# Altium schematic sheet USB-C_Connectors.SchDoc
size A4
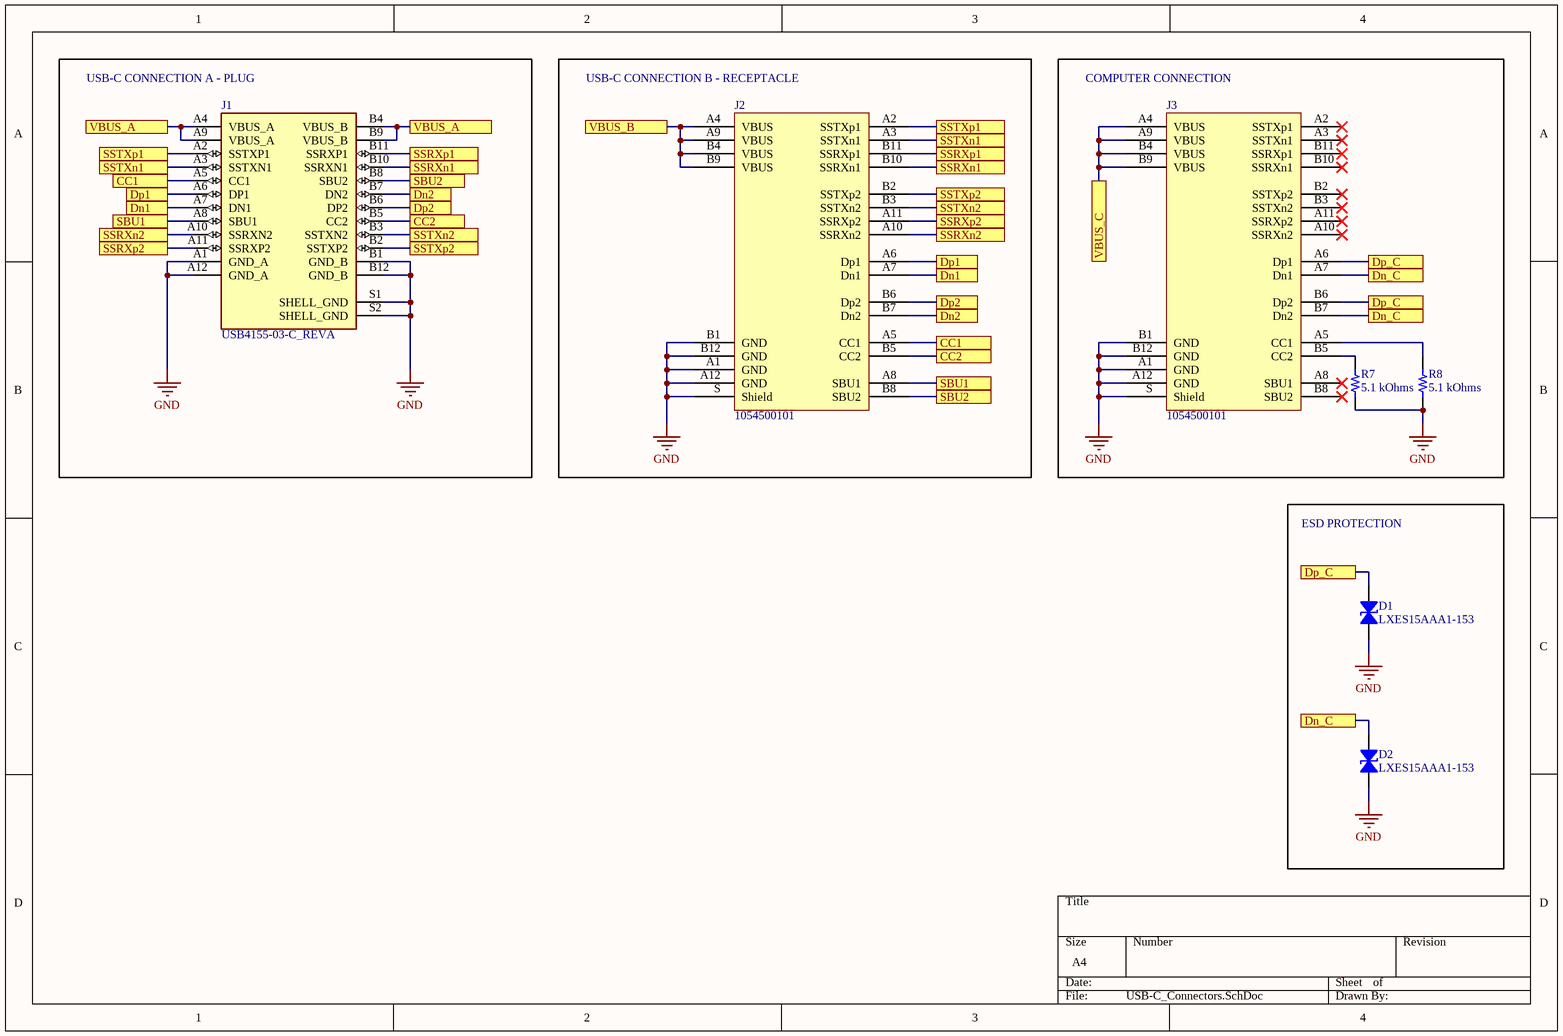
[diagram p0: USB-C_Connectors.SchDoc]

## Parts
D1  LXES15AAA1-153  [0402]
D2  LXES15AAA1-153  [0402]
J1  USB4155-03-C_REVA  [GCT_USB4155-03-C_REVA]
J2  1054500101  [Molex 1054500101]
J3  1054500101  [Molex 1054500101]
R7  5.1 kOhms  [RES 0603_1608]
R8  5.1 kOhms  [RES 0603_1608]

## Blocks framed on the sheet
USB-C CONNECTION A - PLUG: J1
USB-C CONNECTION B - RECEPTACLE: J2
COMPUTER CONNECTION: J3 R7 R8
ESD PROTECTION: D1 D2

## Ports
CC1, CC2, Dn1, Dn2, Dn_C, Dp1, Dp2, Dp_C, SBU1, SBU2, SSRXn1, SSRXn2, SSRXp1, SSRXp2, SSTXn1, SSTXn2, SSTXp1, SSTXp2, VBUS_A, VBUS_B, VBUS_C

## Nets
GND: D1.2 D2.2 J1.A1(GND_A) J1.A12(GND_A) J1.B1(GND_B) J1.B12(GND_B) J1.S1(SHELL_GND) J1.S2(SHELL_GND) J2.A1(GND) J2.A12(GND) J2.B1(GND) J2.B12(GND) J2.S(Shield) J3.A1(GND) J3.A12(GND) J3.B1(GND) J3.B12(GND) J3.S(Shield) R7.1 R8.2
CC1: J1.A5(CC1) J2.A5(CC1) ; port CC1
CC2: J1.B5(CC2) J2.B5(CC2) ; port CC2
Dn1: J1.A7(DN1) J2.A7(Dn1) ; port Dn1
Dn2: J1.B7(DN2) J2.B7(Dn2) ; port Dn2
Dn_C: D2.1 J3.A7(Dn1) J3.B7(Dn2) ; port Dn_C
Dp1: J1.A6(DP1) J2.A6(Dp1) ; port Dp1
Dp2: J1.B6(DP2) J2.B6(Dp2) ; port Dp2
Dp_C: D1.1 J3.A6(Dp1) J3.B6(Dp2) ; port Dp_C
SBU1: J1.A8(SBU1) J2.A8(SBU1) ; port SBU1
SBU2: J1.B8(SBU2) J2.B8(SBU2) ; port SBU2
SSRXn1: J1.B10(SSRXN1) J2.B10(SSRXn1) ; port SSRXn1
SSRXn2: J1.A10(SSRXN2) J2.A10(SSRXn2) ; port SSRXn2
SSRXp1: J1.B11(SSRXP1) J2.B11(SSRXp1) ; port SSRXp1
SSRXp2: J1.A11(SSRXP2) J2.A11(SSRXp2) ; port SSRXp2
SSTXn1: J1.A3(SSTXN1) J2.A3(SSTXn1) ; port SSTXn1
SSTXn2: J1.B3(SSTXN2) J2.B3(SSTXn2) ; port SSTXn2
SSTXp1: J1.A2(SSTXP1) J2.A2(SSTXp1) ; port SSTXp1
SSTXp2: J1.B2(SSTXP2) J2.B2(SSTXp2) ; port SSTXp2
VBUS_A: J1.A4(VBUS_A) J1.A9(VBUS_A) J1.B4(VBUS_B) J1.B9(VBUS_B) ; port VBUS_A
VBUS_B: J2.A4(VBUS) J2.A9(VBUS) J2.B4(VBUS) J2.B9(VBUS) ; port VBUS_B
VBUS_C: J3.A4(VBUS) J3.A9(VBUS) J3.B4(VBUS) J3.B9(VBUS) ; port VBUS_C
NetJ3_A5: J3.A5(CC1) R8.1
NetJ3_B5: J3.B5(CC2) R7.2

Not connected (* = marked no-connect by the designer): J3 A2(SSTXp1)* A3(SSTXn1)* A8(SBU1)* A10(SSRXn2)* A11(SSRXp2)* B2(SSTXp2)* B3(SSTXn2)* B8(SBU2)* B10(SSRXn1)* B11(SSRXp1)*

## Library data of the parts
D1 D2 = LXES15AAA1-153: TVS DIODE 4V 1005; Manufacturer: Murata Electronics; Bidirectional Channels: 1; Capacitance @ Frequency: 0.05pF @ 1MHz; Power Line Protection: No; Type: Zener; Part Number: LXES15AAA1-153; Applications: General Purpose; ComponentLink1Description: Datasheet; ComponentLink1URL: https://www.murata.com/en-us/products/productdata/8796832759838/CRESD-E.pdf; ComponentLink2Description: DigiKey Link; ComponentLink2URL: http://digikey.com/product-detail/en/murata-electronics/LXES15AAA1-153/490-13210-2-ND/5843762; Device Package: 0402 (1005 Metric); LastUpdated: 9/08/2022 12:53:02 PM; Lifecycle Status: Active; Minimum Order: 0; Mounting Type: Surface Mount; Operating Temperature: -40°C ~ 85°C (TA); Package / Case: 0402 (1005 Metric); Packaging: TapeAndReel; PartId: 10448; Part Status: Active; Price: 0.04; Series: -; Supplier 1: DigiKey; Supplier Part Number 1: 490-13210-2-ND; Supplier Device Package: 1005; Voltage - Reverse Standoff (Typ): 4V
J1 = USB4155-03-C_REVA: MF: {'manufacturer': u'Global Connector Technology'}; Value: *; Availability: Unavailable; Package: None; MP: USB4155-03-C_REVA; Price: None
J2 J3 = 1054500101: CONN RCP USB3.1 TYPEC 24P SMD RA; Manufacturer: Molex; Connector Type: USB - C (Type - C); Current Rating (Amps): 0.25A, 1A, 5A; Gender: Receptacle; Mating Cycles: 10000; Number of Contacts: 24; Number of Ports: 1; Shielding: Shielded; Specifications: USB 3.1 (USB 3.1 Gen 2, Superspeed+); Voltage - Rated: 30VAC/DC; Part Number: 1054500101; ComponentLink1Description: Datasheet; ComponentLink1URL: https://www.molex.com/pdm_docs/ps/PS-105448-001.pdf; ComponentLink2Description: DigiKey Link; ComponentLink2URL: http://digikey.com/product-detail/en/molex/1054500101/WM12856CT-ND/5843891; LastUpdated: 6/06/2020 2:14:04 AM; Lifecycle Status: Active; Minimum Order: 1; Mounting Feature: Horizontal; Mounting Type: Surface Mount, Right Angle; Through Hole; Operating Temperature: -30°C ~ 85°C; Packaging: TapeAndReel; Part Status: Active; Price: 1.22; Series: 105445; Supplier 1: DigiKey; Supplier Part Number 1: WM12856CT-ND; Termination: Solder
R7 R8 = RK73B1JTTD512J: RES 5.1K OHM 5% 1/10W 0603; Manufacturer: KOA Speer Electronics, Inc.; Power (Watts): 0.1W, 1/10W; Temperature Coefficient: ±200ppm/°C; Part Number: RK73B1JTTD512J; Value: 5.1 kOhms; ComponentLink1Description: Datasheet; ComponentLink1URL: http://www.koaspeer.com/catimages/Products/RK73B/RK73B.pdf; ComponentLink2Description: DigiKey Link; ComponentLink2URL: https://www.digikey.com/en/products/detail/koa-speer-electronics-inc/RK73B1JTTD512J/9844732; Composition: Thick Film; Device Package: 0603 (1608 Metric); Features: Automotive AEC-Q200; Height - Seated (Max): 0.022" (0.55mm); LastUpdated: 25/08/2022 7:11:50 AM; Lifecycle Status: Active; Minimum Order: 1; Number of Terminations: 2; Operating Temperature: -55°C ~ 155°C; Package / Case: 0603 (1608 Metric); Packaging: CutTape; PartId: 5969; Part Status: Active; Price: 0.01; Ratings: AEC-Q200; Resistance: 5.1 kOhms; Series: RK73B; Size / Dimension: 0.063" L x 0.031" W (1.60mm x 0.80mm); Supplier 1: DigiKey; Supplier Part Number 1: 2019-RK73B1JTTD512JCT-ND; Supplier Device Package: 0603; Tolerance: ±5%